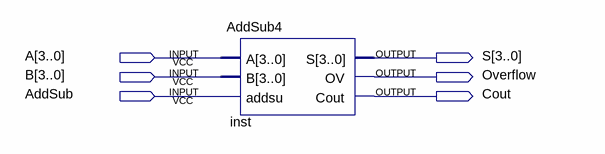
[diagram p0: schematic sheet]
// Quartus schematic AddSubDemo.bdf as structural Verilog: 1 symbols, 6 pins
module AddSubDemo (
  input  [3:0] A,
  input  [3:0] B,
  input  AddSub,
  output [3:0] S,
  output Overflow,
  output Cout
);

  AddSub4 inst (.A(A), .B(B), .addsu(AddSub), .S(S), .OV(Overflow), .Cout(Cout));
endmodule
